# Altium schematic sheet 3_ECG.SchDoc
size A4; SheetNumber: 3; SheetTotal: 3
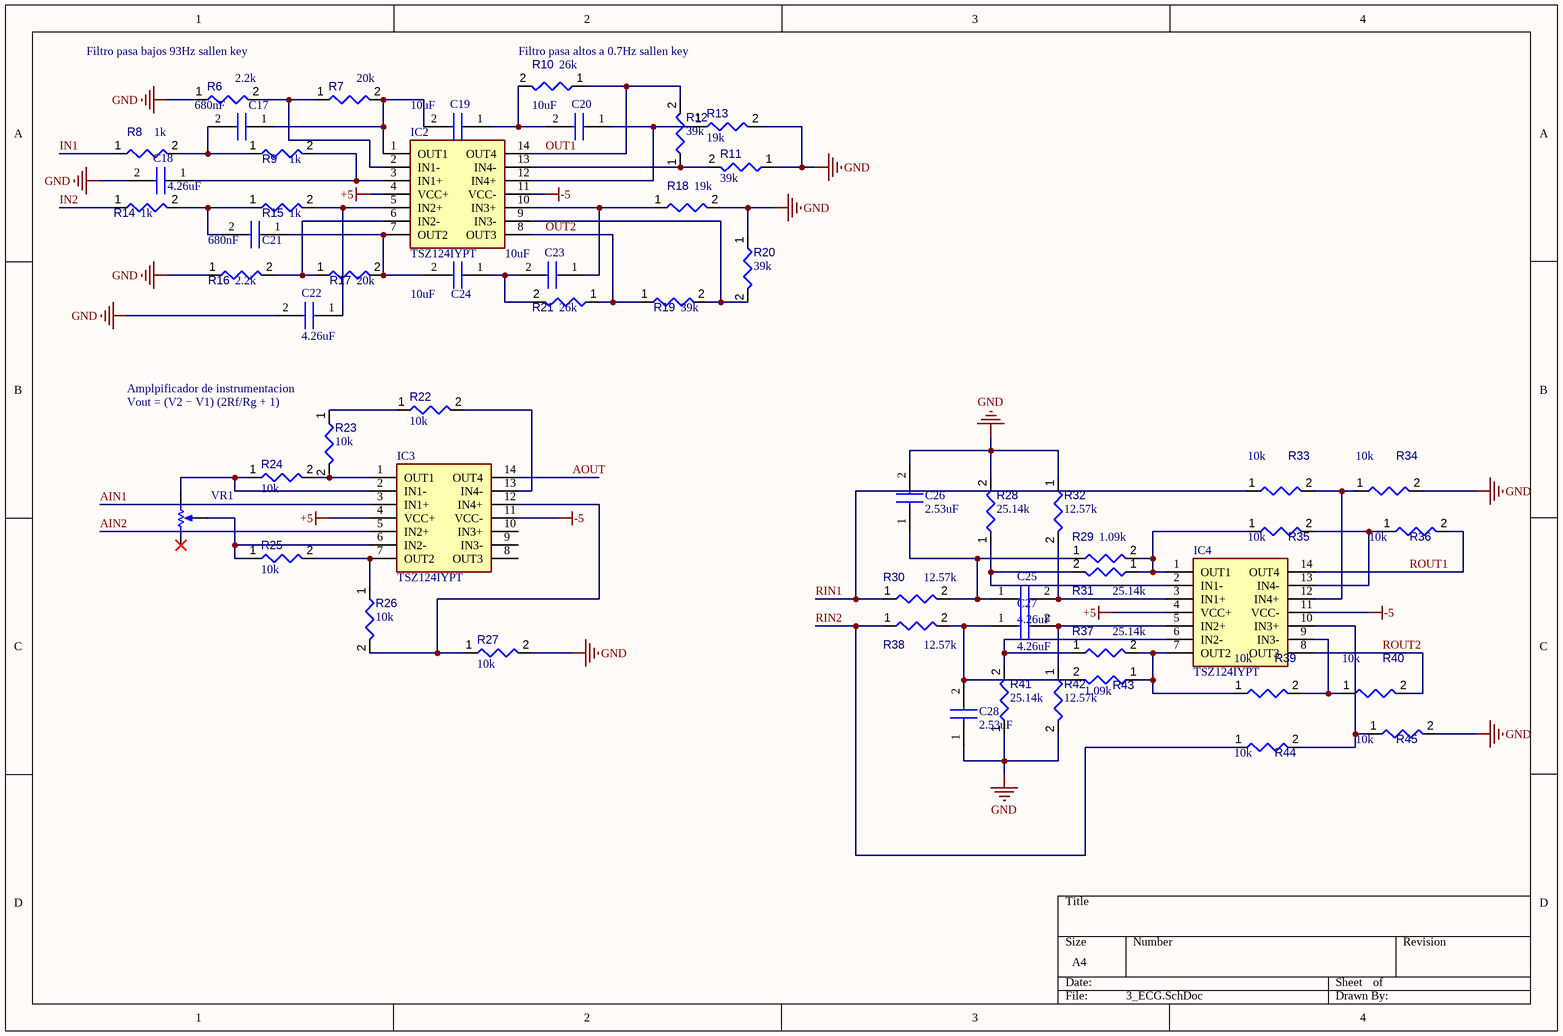
[diagram p0: 3_ECG.SchDoc]

## Parts
C17  680nF  [C322C104K1R5TA]
C18  4.26uF  [C322C104K1R5TA]
C19  10uF  [C322C104K1R5TA]
C20  10uF  [C322C104K1R5TA]
C21  680nF  [C322C104K1R5TA]
C22  4.26uF  [C322C104K1R5TA]
C23  10uF  [C322C104K1R5TA]
C24  10uF  [C322C104K1R5TA]
C25  4.26uF  [C322C104K1R5TA]
C26  2.53uF  [C322C104K1R5TA]
C27  4.26uF  [C322C104K1R5TA]
C28  2.53uF  [C322C104K1R5TA]
IC2  TSZ124IYPT  [SOP65P640X120-14N]
IC3  TSZ124IYPT  [SOP65P640X120-14N]
IC4  TSZ124IYPT  [SOP65P640X120-14N]
R6  2.2k  [RESC1608X55X25ML10T15]
R7  20k  [RESC1608X55X25ML10T15]
R8  1k  [RESC1608X55X25ML10T15]
R9  1k  [RESC1608X55X25ML10T15]
R10  value 26k  [RESC1608X55X25ML10T15]  (hidden comment: 16k)
R11  39k  [RESC1608X55X25ML10T15]
R12  39k  [RESC1608X55X25ML10T15]
R13  19k  [RESC1608X55X25ML10T15]
R14  1k  [RESC1608X55X25ML10T15]
R15  1k  [RESC1608X55X25ML10T15]
R16  2.2k  [RESC1608X55X25ML10T15]
R17  20k  [RESC1608X55X25ML10T15]
R18  19k  [RESC1608X55X25ML10T15]
R19  39k  [RESC1608X55X25ML10T15]
R20  39k  [RESC1608X55X25ML10T15]
R21  26k  [RESC1608X55X25ML10T15]
R22  10k  [RESC1608X55X25ML10T15]
R23  10k  [RESC1608X55X25ML10T15]
R24  10k  [RESC1608X55X25ML10T15]
R25  10k  [RESC1608X55X25ML10T15]
R26  10k  [RESC1608X55X25ML10T15]
R27  10k  [RESC1608X55X25ML10T15]
R28  25.14k  [RESC1608X55X25ML10T15]
R29  value 1.09k  [RESC1608X55X25ML10T15]  (hidden comment: 1k)
R30  value 12.57k  [RESC1608X55X25ML10T15]  (hidden comment: 12.5k)
R31  25.14k  [RESC1608X55X25ML10T15]
R32  12.57k  [RESC1608X55X25ML10T15]
R33  10k  [RESC1608X55X25ML10T15]
R34  10k  [RESC1608X55X25ML10T15]
R35  10k  [RESC1608X55X25ML10T15]
R36  10k  [RESC1608X55X25ML10T15]
R37  25.14k  [RESC1608X55X25ML10T15]
R38  12.57k  [RESC1608X55X25ML10T15]
R39  10k  [RESC1608X55X25ML10T15]
R40  10k  [RESC1608X55X25ML10T15]
R41  25.14k  [RESC1608X55X25ML10T15]
R42  12.57k  [RESC1608X55X25ML10T15]
R43  value 1.09k  [RESC1608X55X25ML10T15]  (hidden comment: 1k)
R44  10k  [RESC1608X55X25ML10T15]
R45  10k  [RESC1608X55X25ML10T15]
VR1  3296W-1-103LF  [BOUR-3296W]  (value not drawn)

## Nets
+5: IC2.4(VCC+) IC3.4(VCC+) IC4.4(VCC+)
-5: IC2.11(VCC-) IC3.11(VCC-) IC4.11(VCC-)
GND: C18.2(-) C22.2(-) C26.2(-) C28.1(+) R6.1 R11.1 R13.2 R16.1 R18.2 R20.1 R27.2 R28.2 R32.1 R34.2 R41.1 R42.2 R45.2
AIN1: IC3.3(IN1+)
AIN2: IC3.5(IN2+)
AOUT: IC3.14(OUT4)
IN1: R8.1
IN2: R14.1
OUT1: IC2.14(OUT4) R10.1 R12.2
OUT2: IC2.8(OUT3) R19.1 R21.1
RIN1: R30.1 R33.1
RIN2: R38.1 R44.1
ROUT1: IC4.14(OUT4) R36.2
ROUT2: IC4.8(OUT3) R40.2
NetC17_1: C17.1(+) C19.2(-) IC2.1(OUT1) R7.2
NetC17_2: C17.2(-) R8.2 R9.1
NetC18_1: C18.1(+) IC2.3(IN1+) R9.2
NetC19_1: C19.1(+) C20.2(-) R10.2
NetC20_1: C20.1(+) IC2.12(IN4+) R13.1
NetC21_1: C21.1(+) C24.2(-) IC2.7(OUT2) R17.2
NetC21_2: C21.2(-) R14.2 R15.1
NetC22_1: C22.1(+) IC2.5(IN2+) R15.2
NetC23_1: C23.1(+) IC2.10(IN3+) R18.1
NetC23_2: C23.2(-) C24.1(+) R21.2
NetC25_1: C25.1(+) C26.1(+) R29.1 R30.2
NetC25_2: C25.2(-) IC4.3(IN1+) R32.2
NetC27_1: C27.1(+) C28.2(-) R38.2 R43.2
NetC27_2: C27.2(-) IC4.5(IN2+) R42.1
NetIC2_2: IC2.2(IN1-) R6.2 R7.1
NetIC2_6: IC2.6(IN2-) R16.2 R17.1
NetIC2_9: IC2.9(IN3-) R19.2 R20.2
NetIC2_13: IC2.13(IN4-) R11.2 R12.1
NetIC3_1: IC3.1(OUT1) R23.2 R24.2
NetIC3_2: IC3.2(IN1-) R24.1 VR1.3(CW)
NetIC3_6: IC3.6(IN2-) R25.1 VR1.2(S)
NetIC3_7: IC3.7(OUT2) R25.2 R26.1
NetIC3_12: IC3.12(IN4+) R26.2 R27.1
NetIC3_13: IC3.13(IN4-) R22.2
NetIC4_1: IC4.1(OUT1) R29.2 R31.1 R35.1
NetIC4_2: IC4.2(IN1-) R28.1 R31.2
NetIC4_6: IC4.6(IN2-) R37.1 R41.2
NetIC4_7: IC4.7(OUT2) R37.2 R39.1 R43.1
NetIC4_9: IC4.9(IN3-) R39.2 R40.1
NetIC4_10: IC4.10(IN3+) R44.2 R45.1
NetIC4_12: IC4.12(IN4+) R33.2 R34.1
NetIC4_13: IC4.13(IN4-) R35.2 R36.1
NetR22_1: R22.1 R23.1

Not connected (* = marked no-connect by the designer): IC3 8(OUT3) 9(IN3-) 10(IN3+); VR1 1(CCW)*

## Notes on the sheet
- Filtro pasa bajos 93Hz sallen key
- (near R10) Filtro pasa altos a 0.7Hz sallen key
- (near R23) Amplpificador de instrumentacion
- (near R23) Vout = (V2 − V1) (2Rf/Rg + 1)

## Library data of the parts
C17-C28 = C322C104M5U5TA: Capacitor; Manufacturer_Name: KEMET; Datasheet Link: https://content.kemet.com/datasheets/KEM_C1051_GOLDMAX_Z5U.pdf; Height: 6.6mm; Manufacturer_Part_Number: C322C104M5U5TA; Mouser Part Number: 80-C322C104M5U; Mouser Price/Stock: https://www.mouser.co.uk/ProductDetail/KEMET/C322C104M5U5TA?qs=CDCeLP2tGBsLrnt3J6Fqow%3D%3D; Arrow Part Number: C322C104M5U5TA; Arrow Price/Stock: https://www.arrow.com/en/products/c322c104m5u5ta/kemet-corporation
IC2-IC4 = TSZ124IYPT: Integrated Circuit; Manufacturer_Name: STMicroelectronics; Datasheet Link: https://mouser.componentsearchengine.com/Datasheets/1/TSZ124IYPT.pdf; Height: 1.2mm; Manufacturer_Part_Number: TSZ124IYPT; Mouser Part Number: 511-TSZ124IYPT; Mouser Price/Stock: https://www.mouser.co.uk/ProductDetail/STMicroelectronics/TSZ124IYPT?qs=4ccVDqXDOrmRxbJcRtShKQ%3D%3D; Arrow Part Number: TSZ124IYPT; Arrow Price/Stock: https://www.arrow.com/en/products/tsz124iypt/stmicroelectronics?region=nac
R6-R20 R29-R45 = CMP-009-00017-5: Chip Resistor, 10 KOhm, +/- 1%, 01 W, -55 to 155 degC, 0603 (1608 Metric); Voltage Rating: 50V; Power: 100mW; RoHS Compliant: True; Min Operating Temperature: -55°C; Pins: 2; Case/Package: 0603; Mounting Technology: SM; Max Operating Temperature: 155°C; Tolerance: 1%
  R6 R16: Value: 2.2k
  R7 R17: Value: 20k
  R8 R9 R14 R15: Value: 1k
  R11 R12 R19 R20: Value: 39k
  R13 R18: Value: 19k
  R31 R37 R41: Value: 25.14k
  R32 R38 R42: Value: 12.57k
  R33-R36 R39 R40 R44 R45: Value: 10k
R21 R28 = CMP-009-00017-5: Voltage Rating: 50V; Power: 100mW; Tolerance: 1%; RoHS Compliant: True; Min Operating Temperature: -55°C; Pins: 2; Case/Package: 0603; Mounting Technology: SM; Max Operating Temperature: 155°C
  R21: Value: 26k
  R28: Value: 25.14k
R22-R27 = CMP-009-00014-5: Chip Resistor, 1 KOhm, +/-1%, 0.1 W, -55 to 155 degC, 0603 (1608 Metric); Voltage Rating: 50V; Power: 100mW; Tolerance: 1%; Mounting Technology: SM; Pins: 2; Case/Package: 0603; Min Operating Temperature: -55°C; RoHS Compliant: True; Max Operating Temperature: 155°C; Value: 10k
VR1 = CMP-009-00038-2: Square Trimpot(R) Trimming Potentiometer, 10 KOhm, +/- 10%, 0.5 W, -55 to 125 degC, 3-Pin THD, RoHS, Tube; Manufacturer: Bourns; Voltage Rating: 300V; Power: 500mW; Resistance: 10k; Tolerance: 10%; Min Operating Temperature: -55°C; Case/Package: 3296W; Max Operating Temperature: 150°C; Package Reference: 3296W; Mounting Technology: TH; Manufacturer URL: http://www.bourns.com/; Package Quantity: 50; Package Description: 3-Pin Through Hole Device, Body 9.53 x 4.83 mm, Pitch 2.54 mm; Packaging: Rail/Tube; Datasheet URL: http://www.bourns.com/docs/Product-Datasheets/3296.pdf; RoHS Compliant: True; Datasheet Version: May-16